# Altium schematic sheet MCU_STM32L010K4T6.SchDoc
size A4; SheetNumber: 6; SheetTotal: 7
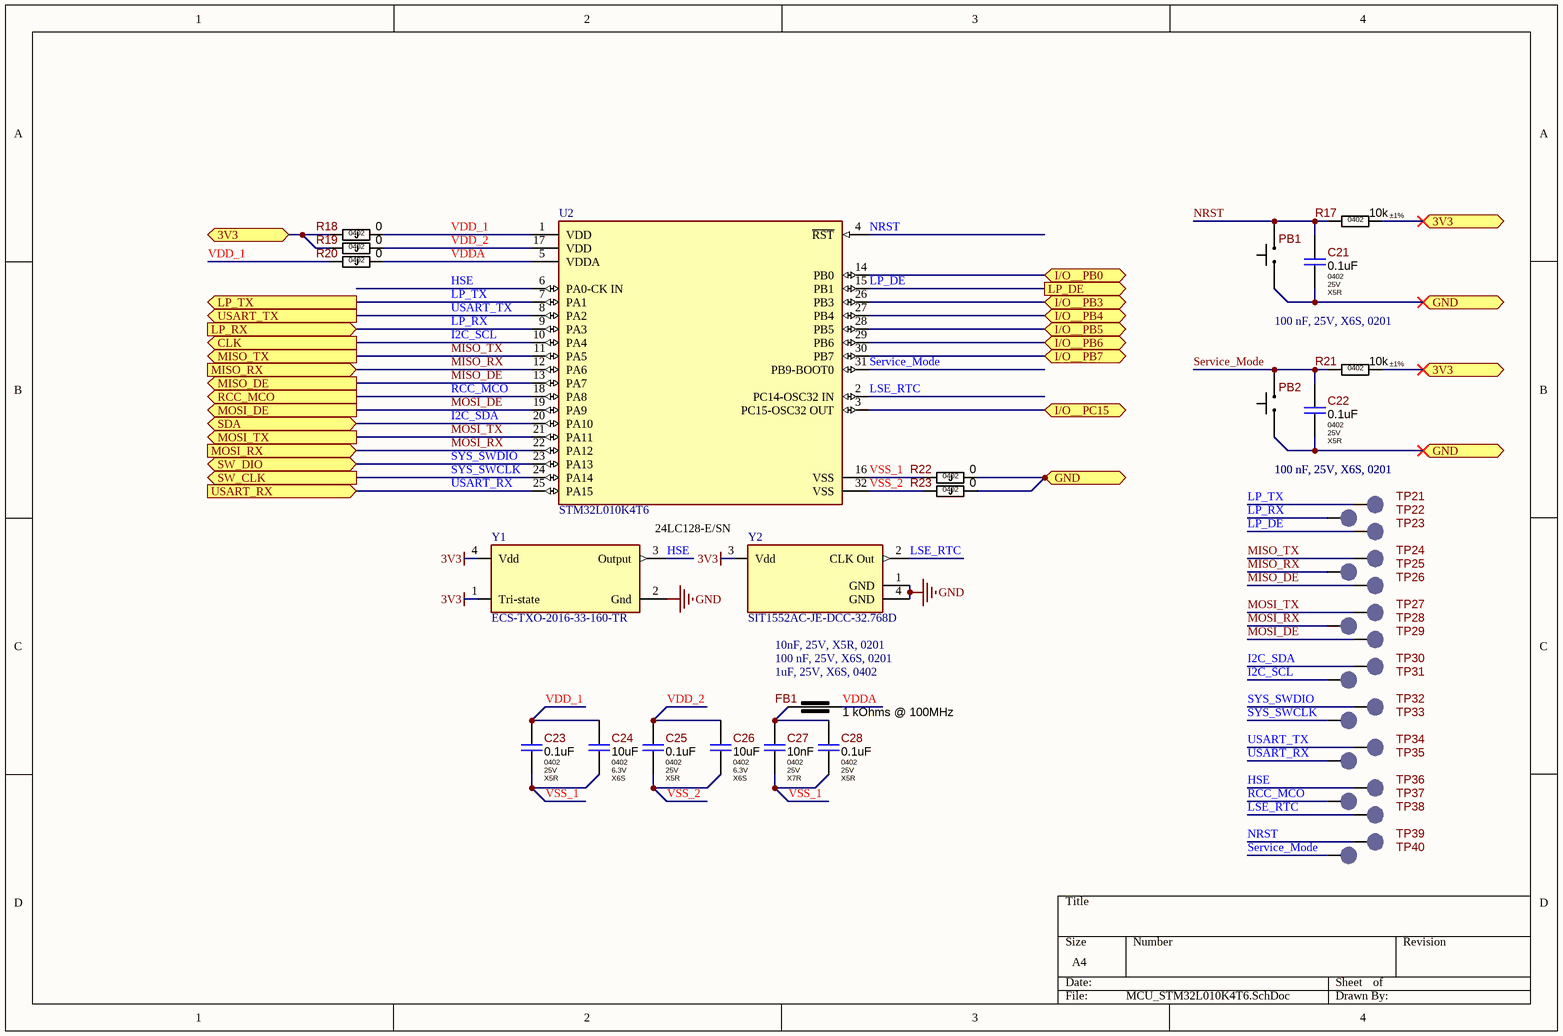
[diagram p0: MCU_STM32L010K4T6.SchDoc]

## Parts
C21  Package: 0402  Voltage: 25V  Dielectric Type: X5R  [C_CERAMIC_0402_HI]  (hidden comment: 0.1uF)
C22  Package: 0402  Voltage: 25V  Dielectric Type: X5R  [C_CERAMIC_0402_HI]  (hidden comment: 0.1uF)
C23  Package: 0402  Voltage: 25V  Dielectric Type: X5R  [C_CERAMIC_0402_HI]  (hidden comment: 0.1uF)
C24  Package: 0402  Voltage: 6.3V  Dielectric Type: X6S  [C_CERAMIC_0402_HI]  (hidden comment: 10uF)
C25  Package: 0402  Voltage: 25V  Dielectric Type: X5R  [C_CERAMIC_0402_HI]  (hidden comment: 0.1uF)
C26  Package: 0402  Voltage: 6.3V  Dielectric Type: X6S  [C_CERAMIC_0402_HI]  (hidden comment: 10uF)
C27  Package: 0402  Voltage: 25V  Dielectric Type: X7R  [C_CERAMIC_0402_HI]  (hidden comment: 10nF)
C28  Package: 0402  Voltage: 25V  Dielectric Type: X5R  [C_CERAMIC_0402_HI]  (hidden comment: 0.1uF)
FB1  value 1 kOhms @ 100MHz  [BLM15xxxxxSN1x_MED]  (hidden comment: BLM15AX102SN1D)
PB1  DS1042-24-2017VBR16005  [DS1042-24-2017VB]  (value not drawn)
PB2  DS1042-24-2017VBR16005  [DS1042-24-2017VB]  (value not drawn)
R17  Tolerance: ±1%  Package: 0402  [R_ANY_CHIP_0402_MED]  (hidden comment: 10k)
R18  Package: 0402  [R_ANY_CHIP_0402_MED]  (hidden comment: 0)
R19  Package: 0402  [R_ANY_CHIP_0402_MED]  (hidden comment: 0)
R20  Package: 0402  [R_ANY_CHIP_0402_MED]  (hidden comment: 0)
R21  Tolerance: ±1%  Package: 0402  [R_ANY_CHIP_0402_MED]  (hidden comment: 10k)
R22  Package: 0402  [R_ANY_CHIP_0402_MED]  (hidden comment: 0)
R23  Package: 0402  [R_ANY_CHIP_0402_MED]  (hidden comment: 0)
TP21  LED_LINK  [TP_SMD_2mm]  (value not drawn)  (no BOM)
TP22  LED_LINK  [TP_SMD_2mm]  (value not drawn)  (no BOM)
TP23  LED_LINK  [TP_SMD_2mm]  (value not drawn)  (no BOM)
TP24  LED_LINK  [TP_SMD_2mm]  (value not drawn)  (no BOM)
TP25  LED_LINK  [TP_SMD_2mm]  (value not drawn)  (no BOM)
TP26  LED_LINK  [TP_SMD_2mm]  (value not drawn)  (no BOM)
TP27  LED_LINK  [TP_SMD_2mm]  (value not drawn)  (no BOM)
TP28  LED_LINK  [TP_SMD_2mm]  (value not drawn)  (no BOM)
TP29  LED_LINK  [TP_SMD_2mm]  (value not drawn)  (no BOM)
TP30  LED_LINK  [TP_SMD_2mm]  (value not drawn)  (no BOM)
TP31  LED_LINK  [TP_SMD_2mm]  (value not drawn)  (no BOM)
TP32  LED_LINK  [TP_SMD_2mm]  (value not drawn)  (no BOM)
TP33  LED_LINK  [TP_SMD_2mm]  (value not drawn)  (no BOM)
TP34  LED_LINK  [TP_SMD_2mm]  (value not drawn)  (no BOM)
TP35  LED_LINK  [TP_SMD_2mm]  (value not drawn)  (no BOM)
TP36  LED_LINK  [TP_SMD_2mm]  (value not drawn)  (no BOM)
TP37  LED_LINK  [TP_SMD_2mm]  (value not drawn)  (no BOM)
TP38  LED_LINK  [TP_SMD_2mm]  (value not drawn)  (no BOM)
TP39  LED_LINK  [TP_SMD_2mm]  (value not drawn)  (no BOM)
TP40  LED_LINK  [TP_SMD_2mm]  (value not drawn)  (no BOM)
U2  STM32L010K4T6  [FP-LQFP32-5V-MFG]
Y1  ECS-TXO-2016-33-160-TR  [FP-TXO-2016-MFG]
Y2  SIT1552AC-JE-DCC-32.768D  [FP-SiT1552-J-MFG]

## Ports
3V3 (bidir, see DefaultProject[3C], DC-DC_5V0_To_3V3[3B]), CLK (out), GND (bidir, see DefaultProject[2C], DC-DC_5V0_To_3V3[2C], DC-DC_24V_To_5V0[1C], ISO_PWR_UCC12040DVER[1C]), I/O__PB0 (bidir, see DefaultProject[2C]), I/O__PB3 (bidir, see DefaultProject[2D]), I/O__PB4 (bidir, see DefaultProject[2C]), I/O__PB5 (bidir, see DefaultProject[2D]), I/O__PB6 (bidir, see DefaultProject[2D]), I/O__PB7 (bidir, see DefaultProject[2D]), I/O__PC15 (bidir, see DefaultProject[2D]), LP_DE (out, see DefaultProject[3C]), LP_RX (in, see DefaultProject[3C]), LP_TX (out, see DefaultProject[3C]), MISO_DE (out, see DefaultProject[3C]), MISO_RX (in, see DefaultProject[3C]), MISO_TX (out, see DefaultProject[3C]), MOSI_DE (out, see DefaultProject[3C]), MOSI_RX (in, see DefaultProject[3C]), MOSI_TX (out, see DefaultProject[3C]), RCC_MCO (out, see DefaultProject[2C]), SDA (bidir), SW_CLK (out, see DefaultProject[2C]), SW_DIO (bidir, see DefaultProject[2C]), USART_RX (in, see DefaultProject[2C]), USART_TX (out, see DefaultProject[2C])

## Nets
3V3: Y1.1(Tri-state) Y1.4(Vdd) Y2.3(Vdd)
GND: Y1.2(Gnd) Y2.1(GND) Y2.4(GND)
3V3: R17.1 R18.2 R19.2 R21.1 ; port 3V3  [a separate net that carries the same name]
GND: C21.2 C22.2 PB1.1 PB2.1 R22.1 R23.1 ; port GND  [a separate net that carries the same name]
HSE: TP36.1 U2.6(PA0-CK_IN) Y1.3(Output)
I2C_SCL: TP31.1 U2.10(PA4) ; port CLK
I2C_SDA: TP30.1 U2.20(PA10) ; port SDA
I/O__PB0: U2.14(PB0) ; port I/O__PB0
I/O__PB3: U2.26(PB3) ; port I/O__PB3
I/O__PB4: U2.27(PB4) ; port I/O__PB4
I/O__PB5: U2.28(PB5) ; port I/O__PB5
I/O__PB6: U2.29(PB6) ; port I/O__PB6
I/O__PB7: U2.30(PB7) ; port I/O__PB7
I/O__PC15: U2.3(PC15-OSC32_OUT) ; port I/O__PC15
LP_DE: TP23.1 U2.15(PB1) ; port LP_DE
LP_RX: TP22.1 U2.9(PA3) ; port LP_RX
LP_TX: TP21.1 U2.7(PA1) ; port LP_TX
LSE_RTC: TP38.1 U2.2(PC14-OSC32_IN) Y2.2(CLK_Out)
MISO_DE: TP26.1 U2.13(PA7) ; port MISO_DE
MISO_RX: TP25.1 U2.12(PA6) ; port MISO_RX
MISO_TX: TP24.1 U2.11(PA5) ; port MISO_TX
MOSI_DE: TP29.1 U2.19(PA9) ; port MOSI_DE
MOSI_RX: TP28.1 U2.22(PA12) ; port MOSI_RX
MOSI_TX: TP27.1 U2.21(PA11) ; port MOSI_TX
NRST: C21.1 PB1.2 R17.2 TP39.1 U2.4(~{RST})
RCC_MCO: TP37.1 U2.18(PA8) ; port RCC_MCO
Service_Mode: C22.1 PB2.2 R21.2 TP40.1 U2.31(PB9-BOOT0)
SYS_SWCLK: TP33.1 U2.24(PA14) ; port SW_CLK
SYS_SWDIO: TP32.1 U2.23(PA13) ; port SW_DIO
USART_RX: TP35.1 U2.25(PA15) ; port USART_RX
USART_TX: TP34.1 U2.8(PA2) ; port USART_TX
VDD_1: C23.1 C24.1 R18.1 R20.2 U2.1(VDD)
VDD_2: C25.1 C26.1 R19.1 U2.17(VDD)
VDDA: FB1.1 R20.1 U2.5(VDDA)
VSS_1: C23.2 C24.2 C27.2 C28.2 R22.2 U2.16(VSS)
VSS_2: C25.2 C26.2 R23.2 U2.32(VSS)
NetC27_1: C27.1 C28.1 FB1.2

## Notes on the sheet
- 100 nF, 25V, X6S, 0201
- 24LC128-E/SN
- 10nF, 25V, X5R, 0201
- (near FB1) 1uF, 25V, X6S, 0402

## Library data of the parts
C21 C22 = Capacitor-NonPolar: 100nF 25V X5R ±10% 0402 Ceramic Capacitor RoHS; Part Number: CL05A104KA5NNNC; Manufacturer: Samsung Electro-Mechanics; Ajax_1C_ID: 27170; Ajax_1C_PN: 100nF 25V X5R 10% 0402 CL05A104KA5NNNC Ceramic Capacitor SMD RoHS; Standard Lead Time: 38 Weeks; Replacement: NONE; Ajax_1С_Status: Mass Production; Component Status: Released; GUID_1C: 6c9121f0-7733-11eb-ab70-0050569f2651; Value: 0.1uF; Part Type: Ceramic / X5R / 0402; Component Type: SMD; Temperature Range: -55°C ~ 85°C; Tolerance: ±10%; ComponentLink1URL: https://eu.mouser.com/datasheet/2/585/MLCC-1837944.pdf; Supplier 1: Mouser; Supplier Part Number 1: 187-CL05A104KA5NNNC; ComponentLink1Description: Datasheet; Price: 0.0013
C23 C25 C28 = Capacitor-NonPolar: 100nF 25V X5R ±10% 0402 Ceramic Capacitor RoHS; Part Number: CL05A104KA5NNNC; Manufacturer: Samsung Electro-Mechanics; Standard Lead Time: 38 Weeks; Component Status: Released; Replacement: NONE; Value: 0.1uF; Part Type: Ceramic / X5R / 0402; Component Type: SMD; Temperature Range: -55°C ~ 85°C; Tolerance: ±10%; ComponentLink1URL: https://eu.mouser.com/datasheet/2/585/MLCC-1837944.pdf; ComponentLink1Description: Datasheet; Price: 0.0013; Supplier 1: Mouser; Supplier Part Number 1: 187-CL05A104KA5NNNC
C24 C26 = Capacitor-NonPolar: 10uF 6.3V X6S ±20% 0402 Ceramic Capacitor RoHS; Part Number: GRM155C80J106ME11D; Manufacturer: Murata Electronics; Component Status: Released; Standard Lead Time: 15 Weeks; Replacement: NONE; Value: 10uF; Part Type: Ceramic / X6S / 0402; Component Type: SMD; Temperature Range: -55°C ~ 105°C; Tolerance: ±20%; ComponentLink1URL: https://search.murata.co.jp/Ceramy/image/img/A01X/G101/ENG/GRM155C80J106ME11-01.pdf; Supplier 1: Digi-Key; Supplier Part Number 1: 490-13233-1-ND; Price: 0.01104; ComponentLink1Description: Datasheet
C27 = Capacitor-NonPolar: 10nF 25V X7R ±10% 0402 Ceramic Capacitor RoHS; Part Number: CL05B103KA5NNNC; Manufacturer: Samsung Electro-Mechanics; Component Status: Released; Standard Lead Time: 28 Weeks; Replacement: NONE; Value: 10nF; Part Type: Ceramic / X7R / 0402; Component Type: SMD; Temperature Range: -55°C ~ 125°C; Tolerance: ±10%; ComponentLink1URL: https://eu.mouser.com/datasheet/2/585/MLCC-1837944.pdf; Supplier 1: Mouser; Supplier Part Number 1: 187-CL05B103KA5NNNC; Price: 0.00145; ComponentLink1Description: Datasheet
FB1 = Ferrite-Bead: 1 kOhms @ 100MHz Ferrite Bead 0402, 350mA 490mOhm; Manufacturer: Murata Electronics; Current: 0.35A; Saturation Current: NONE; Tolerance: ±25%; Standard Lead Time: 7 Weeks; Component Status: Released; Package: 0402; Part Number: BLM15AX102SN1D; Part Type: Ferrite Bead; Component Type: SMD; Temperature Range: -55°C ~ 125°C; ComponentLink1URL: https://www.murata.com/en-us/products/productdata/8796740059166/ENFA0018.pdf; Supplier 1: Digi-Key; Supplier Part Number 1: 490-5442-2-ND; Replacement: NONE; Price: 0.00265; ComponentLink1Description: Datasheet
PB1 PB2 = Tactile-Switch-2-Pin: Tactile Switch 2.5x3mm, SMD, 160gf, Height 1.7mm, 50mA 12VDC; Manufacturer: Connfly; Replacement: NONE; Part Number: DS1042-24-2017VBR16005; Part Type: Switch / Tactile; Component Type: SMD; Temperature Range: -20°C ~ 70°C
R17 R21 = Resistor: 10 kOhms ±1% 1/16W 0402 Thick Film Resistor; Part Number: RC0402FR-0710KL; Manufacturer: Yageo; Power Rating: 0.062W; Voltage: 50V; Temperature Stability: ±100ppm/°C; Replacement: NONE; Component Status: Released; Value: 10k; Component Type: SMD; Temperature Range: -55°C ~ 155°C; ComponentLink1URL: https://eu.mouser.com/datasheet/2/447/PYu_RC_Group_51_RoHS_L_10-1664068.pdf; Supplier 1: Digi-Key; Supplier Part Number 1: 311-10.0KLRTR-ND; ComponentLink1Description: Datasheet; Part Type: Thick Film; Price: 0,00065
R18-R20 R22 R23 = Resistor-J: 0 Ohms Jumper ±5% 1/16W 0402 Thick Film Resistor; Part Number: RC0402JR-070RL; Manufacturer: Yageo; Power Rating: 0.062W; Voltage: 50V; Component Status: Released; Temperature Stability: NONE; Tolerance: ±5%; Value: 0; Component Type: SMD; Part Type: Thick Film; Temperature Range: -55°C ~ 155°C; ComponentLink1URL: https://eu.mouser.com/datasheet/2/447/PYu_RC_Group_51_RoHS_L_10-1664068.pdf; Supplier 1: Digi-Key; Supplier Part Number 1: 311-0.0JRTR-ND; Replacement: NONE; Price: 0.00045; ComponentLink1Description: Datasheet
TP21-TP40 = Test-Point-SMD-1: Test Point SMD Pad 1.0mm/1.5mm/2mm; Part Number: TP-PAD-SMD; Replacement: NONE; Part Type: Test Point; Component Type: SMD; Temperature Range: NONE; ComponentLink1URL: NONE; ComponentLink1Description: Datasheet
U2 = 5ca08d69d3ff88643ab4764b3ac8b6a: 16/32-BITS MICROS; Manufacturer: STMicroelectronics; Number Of Cores: 1; Core Architecture: ARM Cortex-M0+; Number Of Adc Channels: 10; Data Bus Width: 32bits; Frequency: 32MHz; Number Of I/Os: 26; Memory Size: 16KBytes; Max Junction Temp: +105°C; Memory Type: FLASH; Number Of Uart Channels: 2; Ram Size: 2KBytes; Number Of Timers/Counters: 5; Nominal Supply Current: 22-5400uA; Interface: I2C,SPI,UART,USART,SMBus; Min Supply Voltage: 1.8V; Max Supply Voltage: 3.6V; Standoff Height: 0.05mm; ComponentLink2Description: Datasheet; Temperature Range High: +85°C; Device Class L2: Embedded Processors and Controllers; Package: LQFP32-5V; Manufacturer Part Number: STM32L010K4T6; Ambient Temperature Range Low: -40°C; RoHS: TRUE; Digikey Description: 16/32-BITS MICROS; Lead Free: Yes; Category: IC; Height: 1.6mm; ComponentLink2URL: https://www.st.com/resource/en/datasheet/stm32l010f4.pdf; Temperature Range Low: -40°C; Automotive: No; Device Class L3: Microcontrollers; Device Class L1: Integrated Circuits (ICs); Octopart: https://octopart.com/stm32l010k4t6-stmicroelectronics-96493833; Temperature: -40°C to +85°C; Number Of Spi Channels: 1; Number Of I2C Channels: 1; Ambient Temperature Range High: +85°C; Number Of A/D Converters: 1
Y1 = 79411a1daa27f0f3cdd4759ff5fa8e9: XTAL OSC TCXO 16MHZ 3.3V SMD; Manufacturer: ECS; Max Supply Voltage: 3.63V; Max Supply Current: 7mA; Stability: 2ppm; Min Supply Voltage: 2.97V; Load Capacitance: 15pF; Frequency: 16MHz; Device Class L1: Passive Components; Manufacturer Part Number: ECS-TXO-2016-33-160-TR; Digikey Description: XTAL OSC TCXO 16MHZ 3.3V SMD; Device Class L3: Oscillators; Category: Crys; Lead Free: Yes; Temperature: -40°C to +85°C; RoHS: TRUE; ComponentLink2Description: Datasheet; Octopart: https://octopart.com/ecs-txo-2016-33-160-tr-ecs+international-102811109; ComponentLink2URL: https://ecsxtal.com/store/pdf/ECS-TXO-2016.pdf; Temperature Range High: +85°C; Height: 0.8mm; Device Class L2: Crystals / Oscillators; Package: TXO-2016; Temperature Range Low: -40°C; Series: TXO-2016; Automotive: No
Y2 = 3465f1ec27570957a13575eae84d1d8: MEMS OSC TCXO 32.7680KHZ LVCMOS; Frequency Stability: 5ppm; Frequency: 32.768kHz; Min Operating Temperature: 0°C; Length: 0.061inch; Mount: Surface Mount; Max Operating Temperature: 70°C; Width: 0.033inch; RoHS Compliant: Yes; Series: SiT1552; Packaging: Cut Tape; Height: 0.024inch